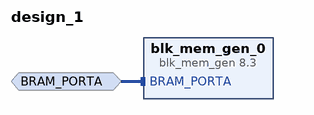
[diagram p0: block diagram of the top level]
# Vivado block design design_1, xc7a35tcpg236-1, Vivado 2016.4
create_bd_design design_1

create_bd_intf_port -mode Slave -vlnv xilinx.com:interface:bram_rtl:1.0 BRAM_PORTA

create_bd_cell -type ip -vlnv xilinx.com:ip:blk_mem_gen:8.3 blk_mem_gen_0
set_property -dict [list \
  CONFIG.Enable_32bit_Address true \
  CONFIG.Enable_A Always_Enabled \
  CONFIG.Register_PortA_Output_of_Memory_Primitives true \
  CONFIG.Load_Init_File true \
  CONFIG.Coe_File ../../../memBlock.coe \
  CONFIG.Fill_Remaining_Memory_Locations true \
  CONFIG.Remaining_Memory_Locations FFFFFFFF \
  CONFIG.Use_RSTA_Pin true \
  CONFIG.use_bram_block Stand_Alone \
] [get_bd_cells blk_mem_gen_0]

# ---- connections ----

connect_bd_intf_net [get_bd_intf_ports BRAM_PORTA] [get_bd_intf_pins blk_mem_gen_0/BRAM_PORTA]

validate_bd_design
save_bd_design
